# Altium project water-sensor-pcb.PrjPcb
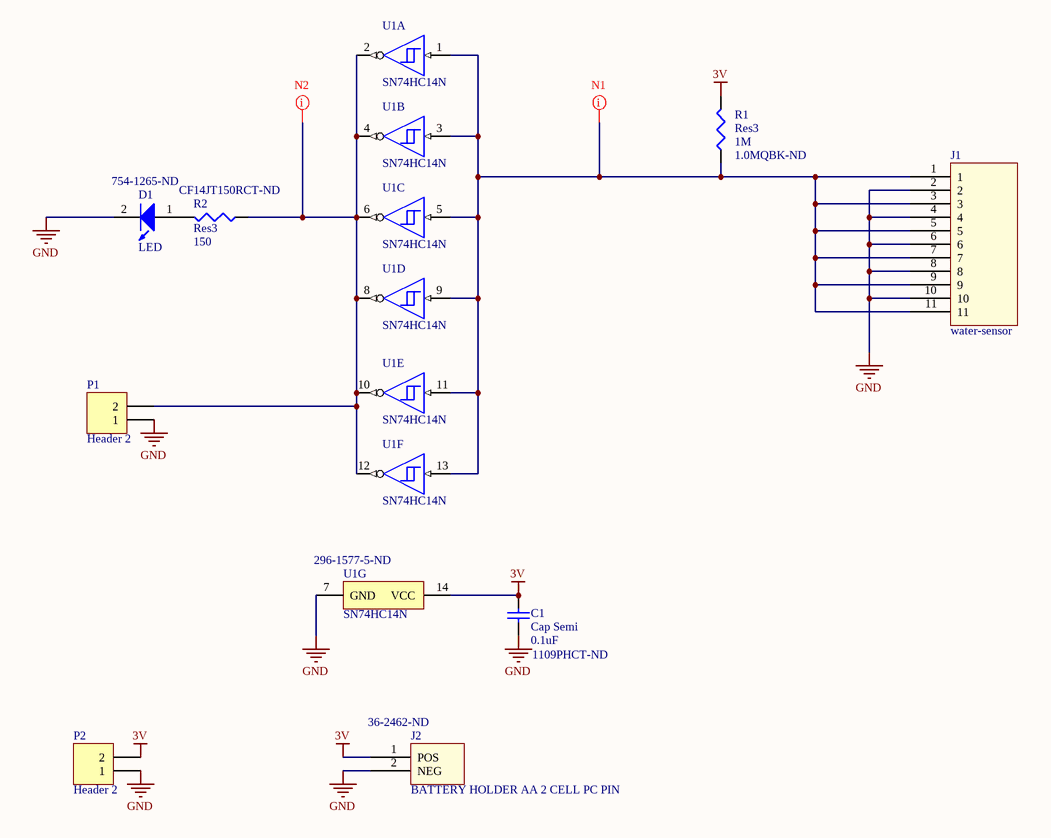
[diagram p0: sensor-1.SchDoc]
1 sheet, 9 parts. Net scope: global (net labels, ports and power ports of the same name join across sheets).
Board file: water-sensor-pcb.PcbDoc

## Sheet sensor-1.SchDoc
size Letter

### Parts
C1  Cap Semi  value 0.1uF  Supplier Part Number 1: 1109PHCT-ND  [A104K15X7RF5TAA]
D1  LED  Supplier Part Number 1: 754-1265-ND  [WP7113LGD]
J1  water-sensor  [water-sensor]
J2  BATTERY HOLDER AA 2 CELL PC PIN  Supplier Part Number 1: 36-2462-ND  [2462]
P1  Header 2  [HDR1X2]
P2  Header 2  [HDR1X2]
R1  Res3  value 1M  Supplier Part Number 1: 1.0MQBK-ND  [CFR-25JB-52-1M]
R2  Res3  value 150  Supplier Part Number 1: CF14JT150RCT-ND  [CF14JT150R]
U1  SN74HC14N  [N0014A]  (parts A,B,C,D,E,F,G of 7)

### Nets
3V: C1.2 J2.1(POS) P2.2 R1.2 U1.14(VCC)
GND: C1.1 D1.2(K) J1.2 J1.4 J1.6 J1.8 J1.10 J2.2(NEG) P1.1 P2.1 U1.7(GND)
NetD1_1: D1.1(A) R2.2
NetJ1_1: J1.1 J1.3 J1.5 J1.7 J1.9 J1.11 R1.1 U1.1(1A) U1.3(2A) U1.5(3A) U1.9(4A) U1.11(5A) U1.13(6A)
NetP1_2: P1.2 R2.1 U1.2(~{1Y}) U1.4(~{2Y}) U1.6(~{3Y}) U1.8(~{4Y}) U1.10(~{5Y}) U1.12(~{6Y})

### Layout directives
mark named N1: NetJ1_1
mark named N2: NetP1_2

### Library data of the parts
C1 = Cap Semi: Capacitor (Semiconductor SIM Model); Manufacturer: Vishay BCcomponents; Capacitance: 100nF; Voltage Rating: 50V; Tolerance: 10%; Dielectric: X7R; Lead Length: 24.3mm; Lead Diameter: 0.5mm; Published: 8-Jun-2000; LatestRevisionDate: 29-May-2009; LatestRevisionNote: IPC-7351 Footprint Added.; PackageReference: C1206; Publisher: Altium Limited; PackageDescription: Chip Capacitor; Supplier 1: Digi-Key; Manufacturer Part Number: A104K15X7RF5TAA; Stock 1: 502711; Pricing 1: 1=0.24000, 10=0.16500, 100=0.09350, 500=0.06598, 1000=0.05773, 2500=0.05498 (USD); RoHS: Yes; Mount: Through Hole,PCB,Axial; Case/Package: Dipped; Contact Plating: Tin; Min Operating Temperature: -55°C; Max Operating Temperature: 125°C; Package Quantity: 1; Packaging: Tape and Reel; Voltage Rating (DC): 50V; Termination: Axial; Voltage: 50V; Diameter: 2.5mm; Length: 3.8mm; Radiation Hardening: No; REACH SVHC: Unknown; Lead Free: Lead Free; ComponentLink1URL: https://datasheet.ciiva.com/145/aseries-145936.pdf?src-supplier=Digi-Key; ComponentLink1Description: https://datasheet.ciiva.com/145/aseries-145936.pdf?src-supplier=Digi-Key; ComponentLink2URL: https://datasheet.ciiva.com/5815/1734588-5815375.pdf?src-supplier=Farnell; ComponentLink2Description: https://datasheet.ciiva.com/5815/1734588-5815375.pdf?src-supplier=Farnell; ComponentLink3URL: https://datasheet.ciiva.com/18442/70122957-18442089.pdf?src-supplier=Allied+Electronics; ComponentLink3Description: https://datasheet.ciiva.com/18442/70122957-18442089.pdf?src-supplier=Allied+Electronics; ComponentLink4URL: https://datasheet.ciiva.com/2988/aseries-2988250.pdf?src-supplier=Avnet; ComponentLink4Description: https://datasheet.ciiva.com/2988/aseries-2988250.pdf?src-supplier=Avnet; ComponentLink5URL: https://datasheet.ciiva.com/17444/aseries-17444908.pdf?src-supplier=Avnet+Europe; ComponentLink5Description: https://datasheet.ciiva.com/17444/aseries-17444908.pdf?src-supplier=Avnet+Europe; ComponentLink6URL: https://datasheet.ciiva.com/46418/1796772-46418252.pdf?src-supplier=Element14; ComponentLink6Description: https://datasheet.ciiva.com/46418/1796772-46418252.pdf?src-supplier=Element14; ComponentLink7URL: https://datasheet.ciiva.com/145/aseries-145935.pdf?src-supplier=Digi-Key; ComponentLink7Description: https://datasheet.ciiva.com/145/aseries-145935.pdf?src-supplier=Digi-Key
D1 = LED: Manufacturer: Kingbright; Color: Green; Lens Style: Round,Diffused,Tinted; Luminous Intensity: 2mcd; Viewing Angle: 30°; Forward Voltage: 1.9V; Forward Current: 25mA; Dominant Wavelength: 568nm; Test Current: 2mA; Supplier 1: Digi-Key; Manufacturer Part Number: WP7113LGD; Stock 1: 86243; Pricing 1: 1=0.48000, 10=0.34200, 100=0.15200, 500=0.10640, 1000=0.08740, 2500=0.07600, 5000=0.06840, 10000=0.06080, 25000=0.05700 (USD); RoHS: Yes; Mount: Through Hole; Case/Package: Radial; Lens Color: Green; Min Operating Temperature: -40°C; Max Operating Temperature: 85°C; Illumination Color: Green; Packaging: Bulk; Package Quantity: 1000; Height: 8.6mm; Lead Free: Lead Free; ComponentLink1URL: https://datasheet.ciiva.com/16510/wp7113lgd-16510240.pdf?src-supplier=Future+Electronics; ComponentLink1Description: https://datasheet.ciiva.com/16510/wp7113lgd-16510240.pdf?src-supplier=Future+Electronics; ComponentLink2URL: https://datasheet.ciiva.com/4692/wp7113lgd-83708-4692822.pdf?src-supplier=Mouser; ComponentLink2Description: https://datasheet.ciiva.com/4692/wp7113lgd-83708-4692822.pdf?src-supplier=Mouser; ComponentLink3URL: https://datasheet.ciiva.com/2114/wp7113lgd-2114397.pdf?src-supplier=Digi-Key; ComponentLink3Description: https://datasheet.ciiva.com/2114/wp7113lgd-2114397.pdf?src-supplier=Digi-Key; ComponentLink4URL: https://datasheet.ciiva.com/14604/70062982-14604412.pdf?src-supplier=Allied+Electronics; ComponentLink4Description: https://datasheet.ciiva.com/14604/70062982-14604412.pdf?src-supplier=Allied+Electronics
J1 = Water-sensor: Water sensor footprint
J2 = 2462: Battery Holder (Open) AA 2 Cell PC Pin; Manufacturer: Keystone Electronics; Body Material: Polypropylene; Number of Cells: 2; Wire/Cable Gauge: 26AWG; Supplier 1: Digi-Key; Manufacturer Part Number: 2462; Stock 1: 19923; Pricing 1: 1=1.21000, 10=0.97300, 50=0.85540, 100=0.85180, 250=0.74188, 500=0.69644, 1000=0.65102, 2500=0.59046, 5000=0.54504 (USD); RoHS: Yes; Mount: Through Hole,PCB; Contact Plating: Nickel; Material: Steel,Plastic; Contact Material: Brass; Package Quantity: 1; Packaging: Bag; Termination: PC Pin; Number of Batteries: 2; Lead Free: Lead Free; REACH SVHC: No SVHC; ComponentLink1URL: https://datasheet.ciiva.com/3/2462-3986.pdf?src-supplier=Digi-Key; ComponentLink1Description: https://datasheet.ciiva.com/3/2462-3986.pdf?src-supplier=Digi-Key; ComponentLink2URL: https://datasheet.ciiva.com/20221/18-3683-20221703.pdf?src-supplier=Rapid+Electronics; ComponentLink2Description: https://datasheet.ciiva.com/20221/18-3683-20221703.pdf?src-supplier=Rapid+Electronics; ComponentLink3URL: https://datasheet.ciiva.com/1391/1714047-1391544.pdf?src-supplier=Element14; ComponentLink3Description: https://datasheet.ciiva.com/1391/1714047-1391544.pdf?src-supplier=Element14; ComponentLink4URL: https://datasheet.ciiva.com/14603/70182746-14603557.pdf?src-supplier=Allied+Electronics; ComponentLink4Description: https://datasheet.ciiva.com/14603/70182746-14603557.pdf?src-supplier=Allied+Electronics; ComponentLink5URL: https://datasheet.ciiva.com/16364/m60-2p26-16364492.pdf?src-supplier=Future+Electronics; ComponentLink5Description: https://datasheet.ciiva.com/16364/m60-2p26-16364492.pdf?src-supplier=Future+Electronics
P1 P2 = Header 2: Header, 2-Pin; LatestRevisionDate: 17-Jul-2002; LatestRevisionNote: Re-released for DXP Platform.; Publisher: Altium Limited
R1 = Res3: Resistor; Manufacturer: Yageo; Tolerance: 5%; Resistance: 1MR; Temperature Coefficient: -1500ppm/°C; Max Power Dissipation: 250mW; Published: 8-Jun-2000; LatestRevisionDate: 29-May-2009; LatestRevisionNote: IPC-7351 Footprint Added.; PackageReference: J1-0603; Publisher: Altium Limited; PackageDescription: Chip Resistor; Supplier 1: Digi-Key; Manufacturer Part Number: CFR-25JB-52-1M; Stock 1: 170936; Pricing 1: 1=0.10000, 10=0.06700, 25=0.04640, 50=0.03600, 100=0.02580, 250=0.02008, 500=0.01596, 1000=0.01133, 5000=0.00876 (USD); RoHS: Yes; Case/Package: Axial; Min Operating Temperature: -55°C; Max Operating Temperature: 155°C; Package Quantity: 200; Packaging: Bulk; Composition: Carbon Film; Number of Terminations: 2; Power Rating: 250mW; Length: 0.248inch; Lead Free: Lead Free; ComponentLink1URL: http://www.yageo.com/NewPortal/yageodocoutput?fileName=/pdf/throughhole/Yageo_LR_CFR_2013.pdf&src-supplier=Digi-Key; ComponentLink1Description: http://www.yageo.com/NewPortal/yageodocoutput?fileName=/pdf/throughhole/Yageo_LR_CFR_2013.pdf&src-supplier=Digi-Key; ComponentLink2URL: http://www.yageo.com/documents/recent/General%20Type_CFR.pdf?src-supplier=Future+Electronics; ComponentLink2Description: http://www.yageo.com/documents/recent/General%20Type_CFR.pdf?src-supplier=Future+Electronics
R2 = Res3: Resistor; Manufacturer: Stackpole Electronics; Resistance: 150R; Power Rating: 250mW; Tolerance: 5%; Temperature Coefficient: -400ppm/°C; Published: 8-Jun-2000; LatestRevisionDate: 29-May-2009; LatestRevisionNote: IPC-7351 Footprint Added.; PackageReference: J1-0603; Publisher: Altium Limited; PackageDescription: Chip Resistor; Supplier 1: Digi-Key; Manufacturer Part Number: CF14JT150R; Stock 1: 54942; Pricing 1: 1=0.10000, 10=0.04000, 25=0.02880, 50=0.02200, 100=0.01620, 250=0.01236, 500=0.00990, 1000=0.00729 (USD); RoHS: Yes; Mount: Through Hole,Axial; Case/Package: Conformal; Contact Plating: Tin,Matte; Min Operating Temperature: -55°C; Max Operating Temperature: 155°C; Package Quantity: 5000; Packaging: Tape and Reel; Composition: Carbon Film; Number of Terminations: 2; Military Standard: Not; Termination: Axial; Max Power Dissipation: 250mW; Features: Flame Retardant Coating; Diameter: 2.3mm; Length: 6.5mm; Radiation Hardening: No; Lead Free: Lead Free; ComponentLink1URL: http://www1.futureelectronics.com/doc/STACKPOLE%20ELECTRONICS/CF-1__4-150R-5%25-R.pdf?src-supplier=Future+Electronics; ComponentLink1Description: http://www1.futureelectronics.com/doc/STACKPOLE%20ELECTRONICS/CF-1__4-150R-5%25-R.pdf?src-supplier=Future+Electronics; ComponentLink2URL: https://www.seielect.com/Catalog/SEI-CF_CFM.pdf?src-supplier=Digi-Key; ComponentLink2Description: https://www.seielect.com/Catalog/SEI-CF_CFM.pdf?src-supplier=Digi-Key; ComponentLink3URL: https://www.seielect.com/catalog/SEI-Packaging.pdf?src-supplier=Digi-Key; ComponentLink3Description: https://www.seielect.com/catalog/SEI-Packaging.pdf?src-supplier=Digi-Key; ComponentLink4URL: https://www.verical.com/server-webapp/html/getDatasheet?partID=360907&src-supplier=Verical; ComponentLink4Description: https://www.verical.com/server-webapp/html/getDatasheet?partID=360907&src-supplier=Verical; ComponentLink5URL: http://components.arrow.com/part/dataview/44988609S3426981N1174?src-supplier=Arrow; ComponentLink5Description: http://components.arrow.com/part/dataview/44988609S3426981N1174?src-supplier=Arrow; ComponentLink6URL: https://www.seielect.com/catalog/SEI-CF_CFM.pdf?src-supplier=Avnet; ComponentLink6Description: https://www.seielect.com/catalog/SEI-CF_CFM.pdf?src-supplier=Avnet; ComponentLink7URL: https://www.seielect.com/catalog/SEI-CF_CFM.pdf?src-supplier=Avnet+Asia; ComponentLink7Description: https://www.seielect.com/catalog/SEI-CF_CFM.pdf?src-supplier=Avnet+Asia
U1 = CMP-1615-00889-3: Hex Schmitt-Trigger Inverters, N0014A, TUBE; Manufacturer: Texas Instruments; Input Type: CMOS; Voltage(Nom)(V): 5; VCC(Min)(V): 2; tpd @ Nom Voltage(Max)(ns): 31; Technology Family: HC; VCC(Max)(V): 6; F @ Nom Voltage(Max)(Mhz): 20; Output Drive (IOL/IOH)(Max)(mA): -4/4; Rating: Catalog; Schmitt Trigger: Yes; ICC @ Nom Voltage(Max)(mA): 0.02; PackageReference: N0014A; Code_JEDEC: MS-001; Operating Temperature Range(C): -40 to 85; Generic Part Number: SN74HC14; Bits(#): 6; DatasheetVersion: SCLS085G; Output Type: CMOS